# Altium project SPEXTRO_PowerBoard.PrjPcb
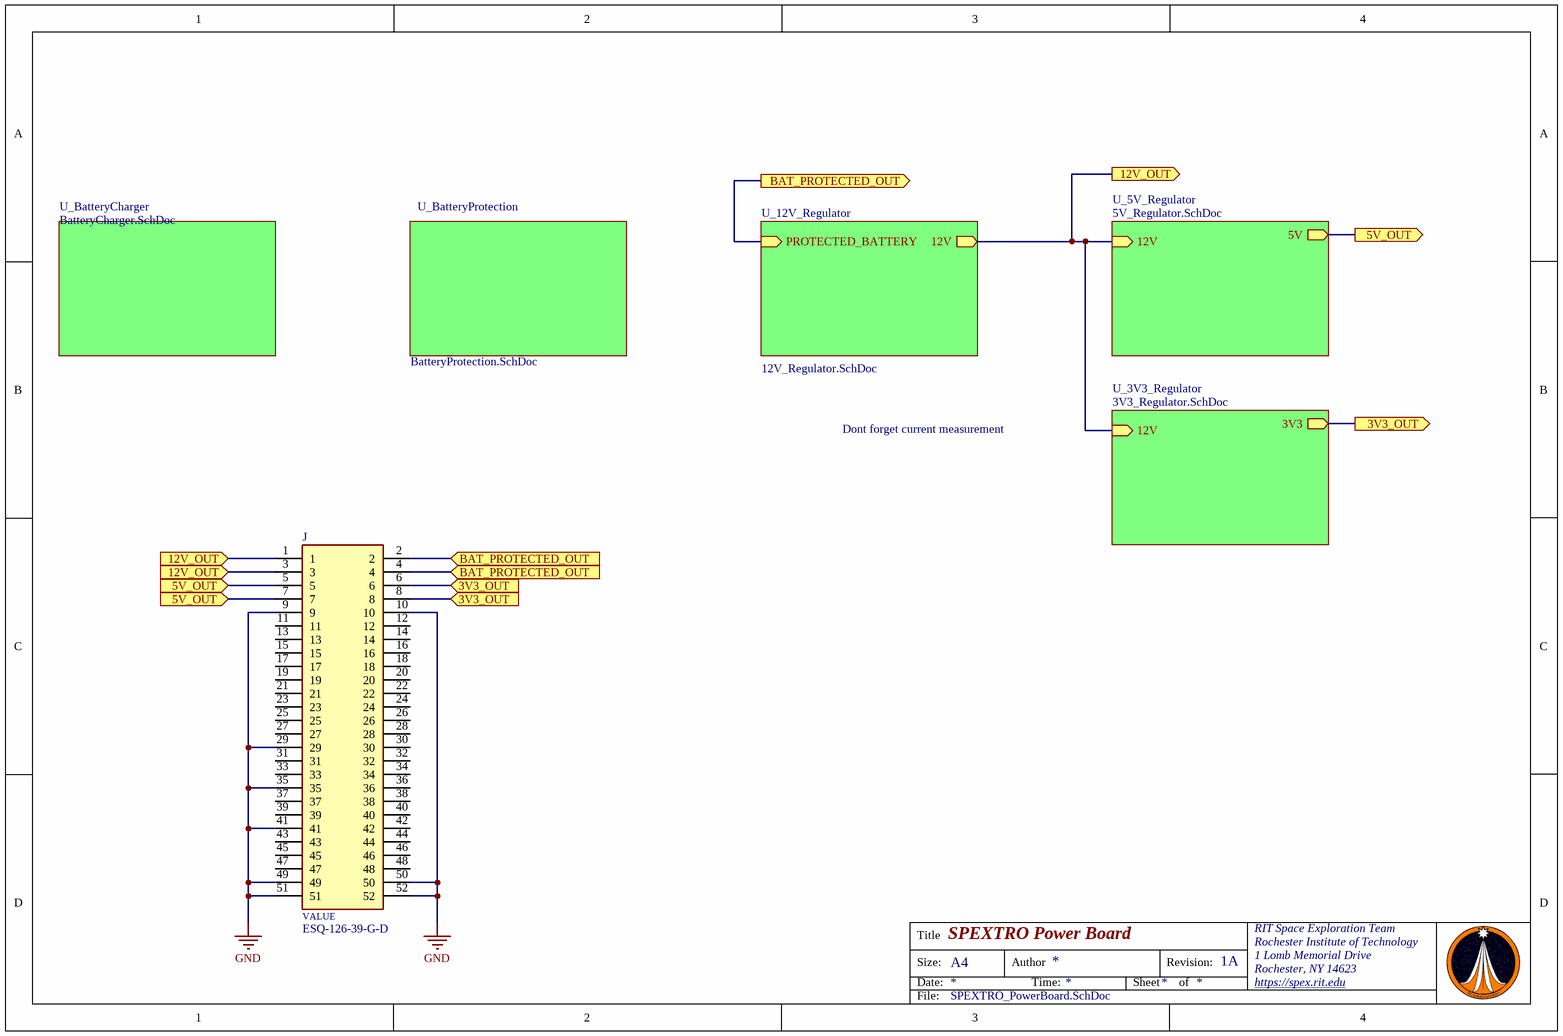
[diagram p0: SPEXTRO_PowerBoard.SchDoc]
6 sheets, 37 parts. Net scope: hierarchical (ports join the sheet entries above them; power ports are global).
Sheets:
  SPEXTRO_PowerBoard.SchDoc
    U_BatteryCharger = BatteryCharger.SchDoc
    U_BatteryProtection = BatteryProtection.SchDoc
    U_12V_Regulator = 12V_Regulator.SchDoc
    U_5V_Regulator = 5V_Regulator.SchDoc
    U_3V3_Regulator = 3V3_Regulator.SchDoc

## Sheet SPEXTRO_PowerBoard.SchDoc: SPEXTRO Power Board
size A4; Revision: 1A

### Parts
J  ESQ-126-39-G-D  [SAMTEC_ESQ-126-39-G-D]

### Sub-sheets
U_3V3_Regulator = 3V3_Regulator.SchDoc: 3V3 (out), 12V (in)
U_5V_Regulator = 5V_Regulator.SchDoc: 5V (out), 12V (in)
U_12V_Regulator = 12V_Regulator.SchDoc: PROTECTED_BATTERY (in), 12V (out)
U_BatteryCharger = BatteryCharger.SchDoc: no entries
U_BatteryProtection = BatteryProtection.SchDoc: no entries

### Ports
3V3_OUT (in), 3V3_OUT (out), 5V_OUT (in), 5V_OUT (out), 12V_OUT (in), 12V_OUT (out), BAT_PROTECTED_OUT (in), BAT_PROTECTED_OUT (out)

### Nets
GND: J.9 J.10 J.29 J.35 J.41 J.49 J.50 J.51 J.52
NetC?#2_2: J.2 J.4 ; port BAT_PROTECTED_OUT, sheet U_12V_Regulator/PROTECTED_BATTERY
NetC?#4_2: J.1 J.3 ; port 12V_OUT, sheet U_12V_Regulator/12V, sheet U_5V_Regulator/12V, sheet U_3V3_Regulator/12V
NetC?#13_2: J.5 J.7 ; port 5V_OUT, sheet U_5V_Regulator/5V
NetC?#17_2: J.6 J.8 ; port 3V3_OUT, sheet U_3V3_Regulator/3V3

Not connected (* = marked no-connect by the designer): J 11 12 13 14 15 16 17 18 19 20 21 22 23 24 25 26 27 28 30 31 32 33 34 36 37 38 39 40 42 43 44 45 46 47 48

### Notes on the sheet
- Dont forget current measurement
- Title
- Size:
- Date:
- A4
- Author
- Time:
- Sheet
- Revision:
- of
- RIT Space Exploration Team
- Rochester Institute of Technology
- 1 Lomb Memorial Drive
- Rochester, NY 14623
- https://spex.rit.edu
- File:
- (in symbol ESQ-126-39-G-D) VALUE

### Library data of the parts
J = ESQ-126-39-G-D: 52 Position Elevated Socket Connector Through Hole; MF: Samtec; Value: *; Digi-Key_Purchase_URL: https://www.digikey.com/product-detail/en/samtec-inc/ESQ-126-39-G-D/SAM10462-ND/3601055?utm_source=snapeda&utm_medium=aggregator&utm_campaign=symbol; Package: None; MP: ESQ-126-39-G-D; SnapEDA_Link: https://www.snapeda.com/parts/ESQ-126-39-G-D/Samtec%20Inc./view-part/490181/?ref=snap; Digi-Key_Part_Number: SAM10462-ND

## Sheet BatteryCharger.SchDoc
size A

## Sheet BatteryProtection.SchDoc
size A

## Sheet 12V_Regulator.SchDoc
size A4
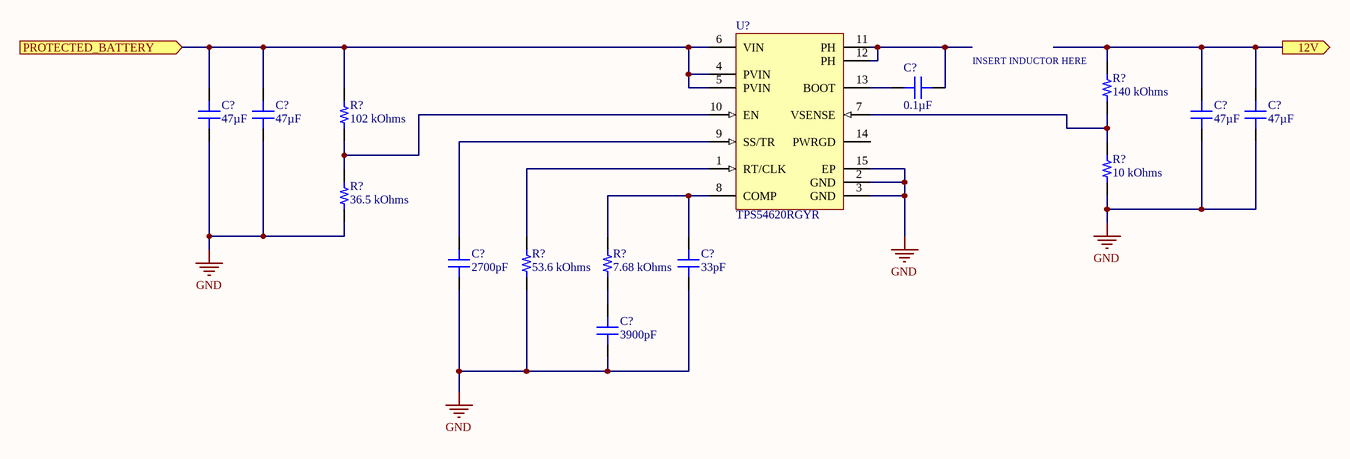
[diagram p1: 12V_Regulator.SchDoc]

### Parts
(Parts that share a designator on the sheet are numbered #1, #2 ... from top to bottom, then left to right.)
C?#1  0.1µF  [CAP 0603_1608]
C?#2  47µF  [CAP 1206_3216 - 1.8MM]
C?#3  47µF  [CAP 1206_3216 - 1.8MM]
C?#4  47µF  [CAP 1206_3216 - 1.8MM]
C?#5  47µF  [CAP 1206_3216 - 1.8MM]
C?#6  2700pF  [CAP 0603_1608]
C?#7  33pF  [CAP 0603_1608]
C?#8  3900pF  [CAP 0603_1608]
R?#1  140 kOhms  [RES 0603_1608]
R?#2  102 kOhms  [RES 0603_1608]
R?#3  10 kOhms  [RES 0603_1608]
R?#4  36.5 kOhms  [RES 0603_1608]
R?#5  53.6 kOhms  [RES 0603_1608]
R?#6  7.68 kOhms  [RES 0603_1608]
U?#1  TPS54620RGYR  [RHL0014A_V]

### Ports
12V (out), PROTECTED_BATTERY (in)

### Nets
GND: C?#2.1 C?#3.1 C?#4.1 C?#5.1 C?#6.1 C?#7.1 C?#8.1 R?#3.1 R?#4.1 R?#5.1 U?#1.2(GND) U?#1.3(GND) U?#1.15(EP)
NetC?#1_1: C?#1.1 U?#1.13(BOOT)
NetC?#1_2: C?#1.2 U?#1.11(PH) U?#1.12(PH)
NetC?#2_2: C?#2.2 C?#3.2 R?#2.2 U?#1.4(PVIN) U?#1.5(PVIN) U?#1.6(VIN) ; port PROTECTED_BATTERY
NetC?#4_2: C?#4.2 C?#5.2 R?#1.2 ; port 12V
NetC?#6_2: C?#6.2 U?#1.9(SS/TR)
NetC?#7_2: C?#7.2 R?#6.2 U?#1.8(COMP)
NetC?#8_2: C?#8.2 R?#6.1
NetR?#1_1: R?#1.1 R?#3.2 U?#1.7(VSENSE)
NetR?#2_1: R?#2.1 R?#4.2 U?#1.10(EN)
NetR?#5_2: R?#5.2 U?#1.1(RT/CLK)

Not connected (* = marked no-connect by the designer): U?#1 14(PWRGD)

### Notes on the sheet
- INSERT INDUCTOR HERE
- Title
- Size:
- Date:
- A4
- Number:
- Time:
- Revision:
- Sheet
- of
- File:

### Library data of the parts
C?#1 = CL10B104KB85PNL: CAP CER 0.1UF 50V X7R 0603; Manufacturer: Samsung Electro-Mechanics; Tolerance: ±10%; Part Number: CL10B104KB85PNL; Value: 0.1µF; Applications: Automotive; Capacitance: 0.1µF; ComponentLink1Description: Datasheet; ComponentLink1URL: http://www.samsungsem.com/kr/support/product-search/mlcc/CL10B104KB85PNL.jsp; ComponentLink2Description: DigiKey Link; ComponentLink2URL: http://digikey.com/product-detail/en/samsung-electro-mechanics/CL10B104KB85PNL/1276-6994-1-ND/7320636; Device Package: 0603 (1608 Metric); LastUpdated: 1/21/2020 12:01:52 AM; Lifecycle Status: Active; Minimum Order: 1; Mounting Type: Surface Mount, MLCC; Operating Temperature: -55°C ~ 125°C; Package / Case: 0603 (1608 Metric); Packaging: TapeAndReel; PartId: 13153; Part Status: Active; Price: 0.02; Ratings: AEC-Q200; Series: CL; Size / Dimension: 0.063" L x 0.031" W (1.60mm x 0.80mm); Supplier 1: DigiKey; Supplier Part Number 1: 1276-6994-1-ND; Temperature Coefficient: X7R; Thickness (Max): 0.035" (0.90mm); Voltage - Rated: 50V
C?#2-C?#5 = GRM31CR61E476ME44L: CAP CER 47UF 25V X5R 1206; Manufacturer: Murata Electronics; Tolerance: ±20%; Part Number: GRM31CR61E476ME44L; Value: 47µF; Applications: General Purpose; Capacitance: 47µF; ComponentLink2Description: DigiKey Link; ComponentLink2URL: http://digikey.com/product-detail/en/murata-electronics/GRM31CR61E476ME44L/490-16268-1-ND/7363259; Device Package: 1206 (3216 Metric); LastUpdated: 1/21/2020 12:03:34 AM; Lifecycle Status: Active; Minimum Order: 1; Mounting Type: Surface Mount, MLCC; Operating Temperature: -55°C ~ 85°C; Package / Case: 1206 (3216 Metric); Packaging: TapeAndReel; PartId: 22811; Part Status: Active; Price: 0.36; Series: GRM; Size / Dimension: 0.126" L x 0.063" W (3.20mm x 1.60mm); Supplier 1: DigiKey; Supplier Part Number 1: 490-16268-1-ND; Temperature Coefficient: X5R; Thickness (Max): 0.071" (1.80mm); Voltage - Rated: 25V
C?#6 = CL10B272KB8NNNC: CAP CER 2700PF 50V X7R 0603; Manufacturer: Samsung Electro-Mechanics; Tolerance: ±10%; Part Number: CL10B272KB8NNNC; Value: 2700pF; Applications: General Purpose; Capacitance: 2700pF; ComponentLink1Description: Datasheet; ComponentLink1URL: http://www.samsungsem.com/kr/support/product-search/mlcc/CL10B272KB8NNNC.jsp; ComponentLink2Description: DigiKey Link; ComponentLink2URL: http://digikey.com/product-detail/en/samsung-electro-mechanics/CL10B272KB8NNNC/1276-2022-1-ND/3890108; Device Package: 0603 (1608 Metric); LastUpdated: 1/21/2020 12:01:43 AM; Lifecycle Status: Active; Minimum Order: 1; Mounting Type: Surface Mount, MLCC; Operating Temperature: -55°C ~ 125°C; Package / Case: 0603 (1608 Metric); Packaging: TapeAndReel; PartId: 16107; Part Status: Active; Price: 0.01; Series: CL; Size / Dimension: 0.063" L x 0.031" W (1.60mm x 0.80mm); Supplier 1: DigiKey; Supplier Part Number 1: 1276-2022-1-ND; Temperature Coefficient: X7R; Thickness (Max): 0.035" (0.90mm); Voltage - Rated: 50V
C?#7 = CC0603JRNPO8BN330: CAP CER 33PF 25V NPO 0603; Manufacturer: Yageo; Temperature Coefficient: C0G, NP0; Tolerance: ±5%; Part Number: CC0603JRNPO8BN330; Value: 33pF; Applications: General Purpose; Capacitance: 33pF; ComponentLink1Description: Datasheet; ComponentLink1URL: https://www.yageo.com/upload/media/product/productsearch/datasheet/mlcc/UPY-GP_NP0_16V-to-50V_17.pdf; ComponentLink2Description: DigiKey Link; ComponentLink2URL: http://digikey.com/product-detail/en/yageo/CC0603JRNPO8BN330/311-3954-1-ND/8025043; Device Package: 0603 (1608 Metric); LastUpdated: 1/21/2020 12:01:58 AM; Lifecycle Status: Active; Minimum Order: 1; Mounting Type: Surface Mount, MLCC; Operating Temperature: -55°C ~ 125°C; Package / Case: 0603 (1608 Metric); Packaging: TapeAndReel; PartId: 9441; Part Status: Active; Price: 0.01; Series: CC; Size / Dimension: 0.063" L x 0.031" W (1.60mm x 0.80mm); Supplier 1: DigiKey; Supplier Part Number 1: 311-3954-1-ND; Thickness (Max): 0.035" (0.90mm); Voltage - Rated: 25V
C?#8 = CC0603KRX7R8BB392: CAP CER 3900PF 25V X7R 0603; Manufacturer: Yageo; Tolerance: ±10%; Part Number: CC0603KRX7R8BB392; Value: 3900pF; Applications: General Purpose; Capacitance: 3900pF; ComponentLink1Description: Datasheet; ComponentLink1URL: https://www.yageo.com/upload/media/product/productsearch/datasheet/mlcc/UPY-GPHC_X7R_6.3V-to-50V_18.pdf; ComponentLink2Description: DigiKey Link; ComponentLink2URL: http://digikey.com/product-detail/en/yageo/CC0603KRX7R8BB392/311-4085-1-ND/8025174; Device Package: 0603 (1608 Metric); LastUpdated: 1/21/2020 12:01:44 AM; Lifecycle Status: Active; Minimum Order: 1; Mounting Type: Surface Mount, MLCC; Operating Temperature: -55°C ~ 125°C; Package / Case: 0603 (1608 Metric); Packaging: TapeAndReel; PartId: 15737; Part Status: Active; Price: 0.01; Series: CC; Size / Dimension: 0.063" L x 0.031" W (1.60mm x 0.80mm); Supplier 1: DigiKey; Supplier Part Number 1: 311-4085-1-ND; Temperature Coefficient: X7R; Thickness (Max): 0.035" (0.90mm); Voltage - Rated: 25V
R?#1 = RMCF0603FT140K: RES 140K OHM 1% 1/10W 0603; Manufacturer: Stackpole Electronics Inc; Power (Watts): 0.1W, 1/10W; Temperature Coefficient: ±100ppm/°C; Part Number: RMCF0603FT140K; Value: 140 kOhms; ComponentLink1Description: Datasheet; ComponentLink1URL: https://www.seielect.com/catalog/sei-packaging.pdf; ComponentLink2Description: DigiKey Link; ComponentLink2URL: http://digikey.com/product-detail/en/stackpole-electronics-inc/RMCF0603FT140K/RMCF0603FT140KCT-ND/4250692; Composition: Thick Film; Device Package: 0603 (1608 Metric); Features: Automotive AEC-Q200; Height - Seated (Max): 0.022" (0.55mm); LastUpdated: 1/21/2020 12:22:36 AM; Lifecycle Status: Active; Minimum Order: 1; Number of Terminations: 2; Operating Temperature: -55°C ~ 155°C; Package / Case: 0603 (1608 Metric); Packaging: CutTape; PartId: 10763; Part Status: Active; Price: 0.10; Ratings: AEC-Q200; Resistance: 140 kOhms; Series: RMCF; Size / Dimension: 0.061" L x 0.031" W (1.55mm x 0.80mm); Supplier 1: DigiKey; Supplier Part Number 1: RMCF0603FT140KCT-ND; Supplier Device Package: 0603; Tolerance: ±1%
R?#2 = RMCF0603FT102K: RES 102K OHM 1% 1/10W 0603; Manufacturer: Stackpole Electronics Inc; Power (Watts): 0.1W, 1/10W; Temperature Coefficient: ±100ppm/°C; Part Number: RMCF0603FT102K; Value: 102 kOhms; ComponentLink1Description: Datasheet; ComponentLink1URL: https://www.seielect.com/catalog/sei-packaging.pdf; ComponentLink2Description: DigiKey Link; ComponentLink2URL: http://digikey.com/product-detail/en/stackpole-electronics-inc/RMCF0603FT102K/RMCF0603FT102KCT-ND/2417908; Composition: Thick Film; Device Package: 0603 (1608 Metric); Features: Automotive AEC-Q200; Height - Seated (Max): 0.022" (0.55mm); LastUpdated: 1/21/2020 12:22:31 AM; Lifecycle Status: Active; Minimum Order: 1; Number of Terminations: 2; Operating Temperature: -55°C ~ 155°C; Package / Case: 0603 (1608 Metric); Packaging: CutTape; PartId: 10887; Part Status: Active; Price: 0.10; Ratings: AEC-Q200; Resistance: 102 kOhms; Series: RMCF; Size / Dimension: 0.061" L x 0.031" W (1.55mm x 0.80mm); Supplier 1: DigiKey; Supplier Part Number 1: RMCF0603FT102KCT-ND; Supplier Device Package: 0603; Tolerance: ±1%
R?#3 = RNCP0603FTD10K0: RES 10K OHM 1% 1/8W 0603; Manufacturer: Stackpole Electronics Inc; Power (Watts): 0.125W, 1/8W; Temperature Coefficient: ±100ppm/°C; Part Number: RNCP0603FTD10K0; Value: 10 kOhms; ComponentLink1Description: Datasheet; ComponentLink1URL: https://www.seielect.com/catalog/sei-rncp.pdf; ComponentLink2Description: DigiKey Link; ComponentLink2URL: http://digikey.com/product-detail/en/stackpole-electronics-inc/RNCP0603FTD10K0/RNCP0603FTD10K0CT-ND/2240478; Composition: Thin Film; Device Package: 0603 (1608 Metric); Features: Anti-Sulfur, Moisture Resistant; Height - Seated (Max): 0.020" (0.50mm); LastUpdated: 1/21/2020 12:17:35 AM; Lifecycle Status: Active; Minimum Order: 1; Number of Terminations: 2; Operating Temperature: -55°C ~ 155°C; Package / Case: 0603 (1608 Metric); Packaging: TapeAndReel; PartId: 22616; Part Status: Active; Price: 0.01; Resistance: 10 kOhms; Series: RNCP; Size / Dimension: 0.059" L x 0.031" W (1.50mm x 0.80mm); Supplier 1: DigiKey; Supplier Part Number 1: RNCP0603FTD10K0CT-ND; Supplier Device Package: 0603; Tolerance: ±1%
R?#4 = RMCF0603FT36K5: RES 36.5K OHM 1% 1/10W 0603; Manufacturer: Stackpole Electronics Inc; Power (Watts): 0.1W, 1/10W; Temperature Coefficient: ±100ppm/°C; Part Number: RMCF0603FT36K5; Value: 36.5 kOhms; ComponentLink1Description: Datasheet; ComponentLink1URL: https://www.seielect.com/catalog/sei-rmcf_rmcp.pdf; ComponentLink2Description: DigiKey Link; ComponentLink2URL: http://digikey.com/product-detail/en/stackpole-electronics-inc/RMCF0603FT36K5/RMCF0603FT36K5CT-ND/1943093; Composition: Thick Film; Device Package: 0603 (1608 Metric); Features: Automotive AEC-Q200; Height - Seated (Max): 0.022" (0.55mm); LastUpdated: 1/21/2020 12:20:18 AM; Lifecycle Status: Active; Minimum Order: 1; Number of Terminations: 2; Operating Temperature: -55°C ~ 155°C; Package / Case: 0603 (1608 Metric); Packaging: CutTape; PartId: 16362; Part Status: Active; Price: 0.10; Ratings: AEC-Q200; Resistance: 36.5 kOhms; Series: RMCF; Size / Dimension: 0.061" L x 0.031" W (1.55mm x 0.80mm); Supplier 1: DigiKey; Supplier Part Number 1: RMCF0603FT36K5CT-ND; Supplier Device Package: 0603; Tolerance: ±1%
R?#5 = RMCF0603FT53K6: RES 53.6K OHM 1% 1/10W 0603; Manufacturer: Stackpole Electronics Inc; Power (Watts): 0.1W, 1/10W; Temperature Coefficient: ±100ppm/°C; Part Number: RMCF0603FT53K6; Value: 53.6 kOhms; ComponentLink1Description: Datasheet; ComponentLink1URL: https://www.seielect.com/catalog/sei-rmcf_rmcp.pdf; ComponentLink2Description: DigiKey Link; ComponentLink2URL: http://digikey.com/product-detail/en/stackpole-electronics-inc/RMCF0603FT53K6/RMCF0603FT53K6CT-ND/1943104; Composition: Thick Film; Device Package: 0603 (1608 Metric); Features: Automotive AEC-Q200; Height - Seated (Max): 0.022" (0.55mm); LastUpdated: 1/21/2020 12:16:54 AM; Lifecycle Status: Active; Minimum Order: 1; Number of Terminations: 2; Operating Temperature: -55°C ~ 155°C; Package / Case: 0603 (1608 Metric); Packaging: CutTape; PartId: 23477; Part Status: Active; Price: 0.10; Ratings: AEC-Q200; Resistance: 53.6 kOhms; Series: RMCF; Size / Dimension: 0.061" L x 0.031" W (1.55mm x 0.80mm); Supplier 1: DigiKey; Supplier Part Number 1: RMCF0603FT53K6CT-ND; Supplier Device Package: 0603; Tolerance: ±1%
R?#6 = RMCF0603FT7K68: RES 7.68K OHM 1% 1/10W 0603; Manufacturer: Stackpole Electronics Inc; Power (Watts): 0.1W, 1/10W; Temperature Coefficient: ±100ppm/°C; Part Number: RMCF0603FT7K68; Value: 7.68 kOhms; ComponentLink1Description: Datasheet; ComponentLink1URL: https://www.seielect.com/catalog/sei-rmcf_rmcp.pdf; ComponentLink2Description: DigiKey Link; ComponentLink2URL: http://digikey.com/product-detail/en/stackpole-electronics-inc/RMCF0603FT7K68/RMCF0603FT7K68CT-ND/4425120; Composition: Thick Film; Device Package: 0603 (1608 Metric); Features: Automotive AEC-Q200; Height - Seated (Max): 0.022" (0.55mm); LastUpdated: 1/21/2020 12:18:38 AM; Lifecycle Status: Active; Minimum Order: 1; Number of Terminations: 2; Operating Temperature: -55°C ~ 155°C; Package / Case: 0603 (1608 Metric); Packaging: CutTape; PartId: 20370; Part Status: Active; Price: 0.10; Ratings: AEC-Q200; Resistance: 7.68 kOhms; Series: RMCF; Size / Dimension: 0.061" L x 0.031" W (1.55mm x 0.80mm); Supplier 1: DigiKey; Supplier Part Number 1: RMCF0603FT7K68CT-ND; Supplier Device Package: 0603; Tolerance: ±1%
U?#1 = CMP-0323-00054-3: Buck Step Down Regulator with 4.5 to 17 V Input and 0.8 to 15 V Output, -40 to 150 degC, 14-Pin VQFN (RGY), Green (RoHS & no Sb/Br); Manufacturer: Texas Instruments; Vout(Max)(V): 15; Vout(Min)(V): 0.8; Rating: Catalog; Vin(Min)(V): 4.5; Iq(Typ)(mA): 0.6; SubFamily: Step-Down Regulator; Synchronous Rectification: TRUE; Regulated Outputs(#): 1; Switch Current Limit(Typ)(A): 8; Iout(Max)(A): 6; Duty Cycle(Max)(%): 98; Vin(Max)(V): 17; Eco-Plan: Green (RoHS & no Sb/Br); PackageReference: RHL0014A; PackageVersion: revI, Jun-2011; ComponentLink2Description: Package Specification; Topology: Buck; DatasheetVersion: SLVS949C; ComponentLink3Description: URL Link1; Code_JEDEC: MO-241-BA; ComponentLink1URL: http://www.ti.com/general/docs/lit/getliterature.tsp?genericPartNumber=TPS54620&fileType=pdf; Mounting Technology: Surface Mount; ComponentLink3URL: Samples URL:http://www.ti.com/product/tps54620#samples; ComponentLink1Description: Datasheet; PartNumber: TPS54620RGYR; PackageDescription: 14-Leads Plastic Quad Flatpack No-Lead, 3.5 x 3.5 x 0.9 mm Body, 0.5 mm Pitch; ComponentLink2URL: http://www.ti.com/litv/pdf/mpqf114g

## Sheet 5V_Regulator.SchDoc
size A
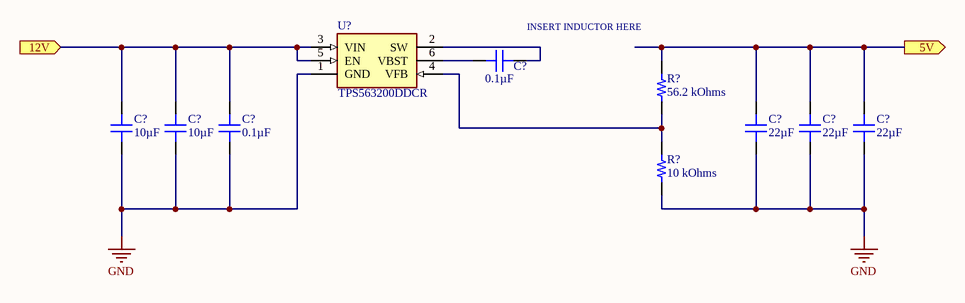
[diagram p2: 5V_Regulator.SchDoc]

### Parts
(Parts that share a designator on the sheet are numbered #1, #2 ... from top to bottom, then left to right.)
C?#9  0.1µF  [CAP 0805_2012]
C?#10  10µF  [CAP 0805_2012]
C?#11  10µF  [CAP 0805_2012]
C?#12  0.1µF  [CAP 0805_2012]
C?#13  22µF  [CAP 0805_2012]
C?#14  22µF  [CAP 0805_2012]
C?#15  22µF  [CAP 0805_2012]
R?#7  56.2 kOhms  [RES 0603_1608]
R?#8  10 kOhms  [RES 0603_1608]
U?#2  TPS563200DDCR  [SOT95P280X110-6N]

### Ports
5V (out), 12V (in)

### Nets
GND: C?#10.1 C?#11.1 C?#12.1 C?#13.1 C?#14.1 C?#15.1 R?#8.1 U?#2.1(GND)
NetC?#4_2: C?#10.2 C?#11.2 C?#12.2 U?#2.3(VIN) U?#2.5(EN) ; port 12V
NetC?#9_1: C?#9.1 U?#2.6(VBST)
NetC?#9_2: C?#9.2 U?#2.2(SW)
NetC?#13_2: C?#13.2 C?#14.2 C?#15.2 R?#7.2 ; port 5V
NetR?#7_1: R?#7.1 R?#8.2 U?#2.4(VFB)

### Notes on the sheet
- (near C?#9) INSERT INDUCTOR HERE

### Library data of the parts
C?#9 C?#12 = UMK212B7104KG-T: CAP CER 0.1UF 50V X7R 0805; Manufacturer: Taiyo Yuden; Tolerance: ±10%; Part Number: UMK212B7104KG-T; Value: 0.1µF; Applications: General Purpose; Capacitance: 0.1µF; ComponentLink1Description: Datasheet; ComponentLink1URL: https://www.yuden.co.jp/productdata/catalog/mlcc01_e.pdf; ComponentLink2Description: DigiKey Link; ComponentLink2URL: http://digikey.com/product-detail/en/taiyo-yuden/UMK212B7104KG-T/587-1279-1-ND/931056; Device Package: 0805 (2012 Metric); LastUpdated: 1/21/2020 12:03:02 AM; Lifecycle Status: Active; Minimum Order: 1; Mounting Type: Surface Mount, MLCC; Operating Temperature: -55°C ~ 125°C; Package / Case: 0805 (2012 Metric); Packaging: TapeAndReel; PartId: 4985; Part Status: Active; Price: 0.02; Series: M; Size / Dimension: 0.079" L x 0.049" W (2.00mm x 1.25mm); Supplier 1: DigiKey; Supplier Part Number 1: 587-1279-1-ND; Temperature Coefficient: X7R; Thickness (Max): 0.053" (1.35mm); Voltage - Rated: 50V
C?#10 C?#11 = TMK212BBJ106KGHT: CAP CER 10UF 25V X5R 0805; Manufacturer: Taiyo Yuden; Tolerance: ±10%; Part Number: TMK212BBJ106KGHT; Value: 10µF; Applications: Automotive; Capacitance: 10µF; ComponentLink1Description: Datasheet; ComponentLink1URL: https://www.yuden.co.jp/productdata/catalog/mlcc_all_hq_e.pdf; ComponentLink2Description: DigiKey Link; ComponentLink2URL: http://digikey.com/product-detail/en/taiyo-yuden/TMK212BBJ106KGHT/587-4334-1-ND/5400908; Device Package: 0805 (2012 Metric); LastUpdated: 1/21/2020 12:03:03 AM; Lifecycle Status: Active; Minimum Order: 1; Mounting Type: Surface Mount, MLCC; Operating Temperature: -55°C ~ 85°C; Package / Case: 0805 (2012 Metric); Packaging: TapeAndReel; PartId: 4818; Part Status: Active; Price: 0.07; Ratings: AEC-Q200; Series: M; Size / Dimension: 0.079" L x 0.049" W (2.00mm x 1.25mm); Supplier 1: DigiKey; Supplier Part Number 1: 587-4334-1-ND; Temperature Coefficient: X5R; Thickness (Max): 0.053" (1.35mm); Voltage - Rated: 25V
C?#13-C?#15 = LMK212BBJ226MG-T: CAP CER 22UF 10V X5R 0805; Manufacturer: Taiyo Yuden; Tolerance: ±20%; Part Number: LMK212BBJ226MG-T; Value: 22µF; Applications: SMPS Filtering; Capacitance: 22µF; ComponentLink1Description: Datasheet; ComponentLink1URL: https://ds.yuden.co.jp/TYCOMPAS/ut/detail?pn=LMK212BBJ226MG-T &u=M; ComponentLink2Description: DigiKey Link; ComponentLink2URL: http://digikey.com/product-detail/en/taiyo-yuden/LMK212BBJ226MG-T/587-5464-1-ND/7067140; Device Package: 0805 (2012 Metric); LastUpdated: 1/21/2020 12:02:43 AM; Lifecycle Status: Active; Minimum Order: 1; Mounting Type: Surface Mount, MLCC; Operating Temperature: -55°C ~ 85°C; Package / Case: 0805 (2012 Metric); Packaging: TapeAndReel; PartId: 16243; Part Status: Active; Price: 0.06; Series: M; Size / Dimension: 0.079" L x 0.049" W (2.00mm x 1.25mm); Supplier 1: DigiKey; Supplier Part Number 1: 587-5464-1-ND; Temperature Coefficient: X5R; Thickness (Max): 0.057" (1.45mm); Voltage - Rated: 10V
R?#7 = RMCF0603FT56K2: RES 56.2K OHM 1% 1/10W 0603; Manufacturer: Stackpole Electronics Inc; Power (Watts): 0.1W, 1/10W; Temperature Coefficient: ±100ppm/°C; Part Number: RMCF0603FT56K2; Value: 56.2 kOhms; ComponentLink1Description: Datasheet; ComponentLink1URL: https://www.seielect.com/catalog/sei-rmcf_rmcp.pdf; ComponentLink2Description: DigiKey Link; ComponentLink2URL: http://digikey.com/product-detail/en/stackpole-electronics-inc/RMCF0603FT56K2/RMCF0603FT56K2CT-ND/1943105; Composition: Thick Film; Device Package: 0603 (1608 Metric); Features: Automotive AEC-Q200; Height - Seated (Max): 0.022" (0.55mm); LastUpdated: 1/21/2020 12:22:37 AM; Lifecycle Status: Active; Minimum Order: 1; Number of Terminations: 2; Operating Temperature: -55°C ~ 155°C; Package / Case: 0603 (1608 Metric); Packaging: CutTape; PartId: 10739; Part Status: Active; Price: 0.10; Ratings: AEC-Q200; Resistance: 56.2 kOhms; Series: RMCF; Size / Dimension: 0.061" L x 0.031" W (1.55mm x 0.80mm); Supplier 1: DigiKey; Supplier Part Number 1: RMCF0603FT56K2CT-ND; Supplier Device Package: 0603; Tolerance: ±1%
R?#8 = TNPW060310K0FHTA: RES 10K OHM 1% 1/10W 0603; Manufacturer: Vishay Dale; Power (Watts): 0.1W, 1/10W; Temperature Coefficient: ±50ppm/°C; Part Number: TNPW060310K0FHTA; Value: 10 kOhms; ComponentLink2Description: DigiKey Link; ComponentLink2URL: http://digikey.com/product-detail/en/vishay-dale/TNPW060310K0FHTA/541-3906-1-ND/7355264; Composition: Thin Film; Device Package: 0603 (1608 Metric); Features: Military; Height - Seated (Max): 0.022" (0.55mm); LastUpdated: 1/21/2020 12:23:11 AM; Lifecycle Status: Active; Minimum Order: 1; Number of Terminations: 2; Operating Temperature: -55°C ~ 125°C; Package / Case: 0603 (1608 Metric); Packaging: TapeAndReel; PartId: 9361; Part Status: Active; Price: 0.07; Resistance: 10 kOhms; Series: TNPW; Size / Dimension: 0.063" L x 0.033" W (1.60mm x 0.85mm); Supplier 1: DigiKey; Supplier Part Number 1: 541-3906-1-ND; Supplier Device Package: 0603; Tolerance: ±1%
U?#2 = TPS563200DDCR: Buck Switching Regulator IC Positive Adjustable 0.76V 1 Output 3A SOT-23-6 Thin, TSOT-23-6; MF: Texas Instruments; Package: TSOT-23 Texas Instruments; Value: *; Price: None; MP: TPS563200DDCR; SnapEDA_Link: https://www.snapeda.com/parts/TPS563200DDCR/Texas%20Instruments/view-part/71685/?ref=snap; Availability: Unavailable

## Sheet 3V3_Regulator.SchDoc
size A
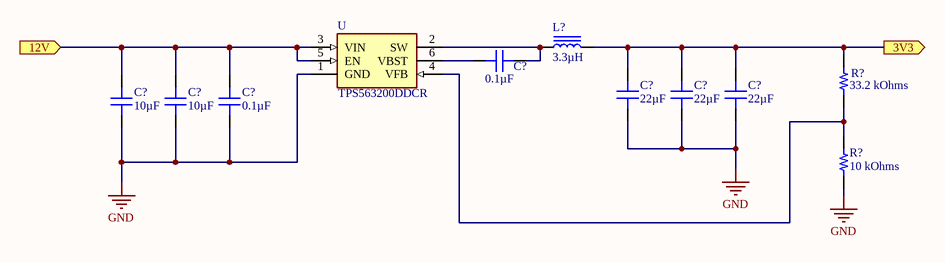
[diagram p3: 3V3_Regulator.SchDoc]

### Parts
(Parts that share a designator on the sheet are numbered #1, #2 ... from top to bottom, then left to right.)
C?#16  0.1µF  [CAP 0805_2012]
C?#17  22µF  [CAP 0805_2012]
C?#18  22µF  [CAP 0805_2012]
C?#19  22µF  [CAP 0805_2012]
C?#20  10µF  [CAP 0805_2012]
C?#21  10µF  [CAP 0805_2012]
C?#22  0.1µF  [CAP 0805_2012]
L?  3.3µH  [TDK VLCF4024-2]
R?#9  33.2 kOhms  [RES 0603_1608]
R?#10  10 kOhms  [RES 0603_1608]
U  TPS563200DDCR  [SOT95P280X110-6N]

### Ports
3V3 (out), 12V (in)

### Nets
GND: C?#17.1 C?#18.1 C?#19.1 C?#20.1 C?#21.1 C?#22.1 R?#10.1 U.1(GND)
NetC?#4_2: C?#20.2 C?#21.2 C?#22.2 U.3(VIN) U.5(EN) ; port 12V
NetC?#16_1: C?#16.1 U.6(VBST)
NetC?#16_2: C?#16.2 L?.1 U.2(SW)
NetC?#17_2: C?#17.2 C?#18.2 C?#19.2 L?.2 R?#9.2 ; port 3V3
NetR?#9_1: R?#9.1 R?#10.2 U.4(VFB)

### Library data of the parts
C?#16 C?#22 = UMK212B7104KG-T: as C?#9 on sheet 5V_Regulator; Part Number: UMK212B7104KG-T; Value: 0.1µF; Applications: General Purpose; Capacitance: 0.1µF; ComponentLink1Description: Datasheet; ComponentLink1URL: https://www.yuden.co.jp/productdata/catalog/mlcc01_e.pdf; ComponentLink2Description: DigiKey Link; ComponentLink2URL: http://digikey.com/product-detail/en/taiyo-yuden/UMK212B7104KG-T/587-1279-1-ND/931056; Device Package: 0805 (2012 Metric); LastUpdated: 1/21/2020 12:03:02 AM; Lifecycle Status: Active; Minimum Order: 1; Mounting Type: Surface Mount, MLCC; Operating Temperature: -55°C ~ 125°C; Package / Case: 0805 (2012 Metric); Packaging: TapeAndReel; PartId: 4985; Part Status: Active; Price: 0.02; Series: M; Size / Dimension: 0.079" L x 0.049" W (2.00mm x 1.25mm); Supplier 1: DigiKey; Supplier Part Number 1: 587-1279-1-ND; Temperature Coefficient: X7R; Thickness (Max): 0.053" (1.35mm); Voltage - Rated: 50V
C?#17-C?#19 = LMK212BBJ226MG-T: as C?#13 on sheet 5V_Regulator; Part Number: LMK212BBJ226MG-T; Value: 22µF; Applications: SMPS Filtering; Capacitance: 22µF; ComponentLink1Description: Datasheet; ComponentLink1URL: https://ds.yuden.co.jp/TYCOMPAS/ut/detail?pn=LMK212BBJ226MG-T &u=M; ComponentLink2Description: DigiKey Link; ComponentLink2URL: http://digikey.com/product-detail/en/taiyo-yuden/LMK212BBJ226MG-T/587-5464-1-ND/7067140; Device Package: 0805 (2012 Metric); LastUpdated: 1/21/2020 12:02:43 AM; Lifecycle Status: Active; Minimum Order: 1; Mounting Type: Surface Mount, MLCC; Operating Temperature: -55°C ~ 85°C; Package / Case: 0805 (2012 Metric); Packaging: TapeAndReel; PartId: 16243; Part Status: Active; Price: 0.06; Series: M; Size / Dimension: 0.079" L x 0.049" W (2.00mm x 1.25mm); Supplier 1: DigiKey; Supplier Part Number 1: 587-5464-1-ND; Temperature Coefficient: X5R; Thickness (Max): 0.057" (1.45mm); Voltage - Rated: 10V
C?#20 C?#21 = TMK212BBJ106KGHT: as C?#10 on sheet 5V_Regulator; Part Number: TMK212BBJ106KGHT; Value: 10µF; Applications: Automotive; Capacitance: 10µF; ComponentLink1Description: Datasheet; ComponentLink1URL: https://www.yuden.co.jp/productdata/catalog/mlcc_all_hq_e.pdf; ComponentLink2Description: DigiKey Link; ComponentLink2URL: http://digikey.com/product-detail/en/taiyo-yuden/TMK212BBJ106KGHT/587-4334-1-ND/5400908; Device Package: 0805 (2012 Metric); LastUpdated: 1/21/2020 12:03:03 AM; Lifecycle Status: Active; Minimum Order: 1; Mounting Type: Surface Mount, MLCC; Operating Temperature: -55°C ~ 85°C; Package / Case: 0805 (2012 Metric); Packaging: TapeAndReel; PartId: 4818; Part Status: Active; Price: 0.07; Ratings: AEC-Q200; Series: M; Size / Dimension: 0.079" L x 0.049" W (2.00mm x 1.25mm); Supplier 1: DigiKey; Supplier Part Number 1: 587-4334-1-ND; Temperature Coefficient: X5R; Thickness (Max): 0.053" (1.35mm); Voltage - Rated: 25V
L? = VLCF5024T-3R3N1R4-2: FIXED IND 3.3UH 1.46A 37 MOHM; Manufacturer: TDK Corporation; DC Resistance (DCR): 37mOhm Max; Inductance Frequency - Test: 100kHz; Material - Core: Ferrite; Shielding: Shielded; Tolerance: ±30%; Type: Wirewound; Part Number: VLCF5024T-3R3N1R4-2; ComponentLink1Description: Datasheet; ComponentLink1URL: https://product.tdk.com/info/en/catalog/datasheets/inductor_commercial_power_vlcf5024-2_en.pdf?ref_disty=digikey; ComponentLink2Description: DigiKey Link; ComponentLink2URL: http://digikey.com/product-detail/en/tdk-corporation/VLCF5024T-3R3N1R4-2/445-8746-1-ND/3083348; Current Rating (Amps): 1.46A; Current - Saturation: 1.46A; Device Package: Nonstandard; Height - Seated (Max): 0.094" (2.40mm); Inductance: 3.3µH; LastUpdated: 1/21/2020 3:26:16 AM; Lifecycle Status: Active; Minimum Order: 1; Mounting Type: Surface Mount; Operating Temperature: -40°C ~ 105°C; Package / Case: Nonstandard; Packaging: TapeAndReel; PartId: 157; Part Status: Active; Price: 0.63; Series: VLCF; Size / Dimension: 0.197" L x 0.197" W (5.00mm x 5.00mm); Supplier 1: DigiKey; Supplier Part Number 1: 445-8746-1-ND; Value: 3.3µH
R?#9 = RT0603FRE0733K2L: RES SMD 33.2K OHM 1% 1/10W 0603; Manufacturer: Yageo; Power (Watts): 0.1W, 1/10W; Temperature Coefficient: ±50ppm/°C; Part Number: RT0603FRE0733K2L; Value: 33.2 kOhms; ComponentLink1Description: Datasheet; ComponentLink1URL: https://www.yageo.com/upload/media/product/productsearch/datasheet/rchip/PYu-RT_1-to-0.01_RoHS_L_11.pdf; ComponentLink2Description: DigiKey Link; ComponentLink2URL: http://digikey.com/product-detail/en/yageo/RT0603FRE0733K2L/YAG5958CT-ND/9370988; Composition: Thin Film; Device Package: 0603 (1608 Metric); Height - Seated (Max): 0.022" (0.55mm); LastUpdated: 1/21/2020 12:20:29 AM; Lifecycle Status: Active; Minimum Order: 1; Number of Terminations: 2; Operating Temperature: -55°C ~ 155°C; Package / Case: 0603 (1608 Metric); Packaging: TapeAndReel; PartId: 16004; Part Status: Active; Price: 0.01; Resistance: 33.2 kOhms; Series: RT; Size / Dimension: 0.063" L x 0.031" W (1.60mm x 0.80mm); Supplier 1: DigiKey; Supplier Part Number 1: YAG5958CT-ND; Supplier Device Package: 0603; Tolerance: ±1%
R?#10 = TNPW060310K0FHTA: as R?#8 on sheet 5V_Regulator; Part Number: TNPW060310K0FHTA; Value: 10 kOhms; ComponentLink2Description: DigiKey Link; ComponentLink2URL: http://digikey.com/product-detail/en/vishay-dale/TNPW060310K0FHTA/541-3906-1-ND/7355264; Composition: Thin Film; Device Package: 0603 (1608 Metric); Features: Military; Height - Seated (Max): 0.022" (0.55mm); LastUpdated: 1/21/2020 12:23:11 AM; Lifecycle Status: Active; Minimum Order: 1; Number of Terminations: 2; Operating Temperature: -55°C ~ 125°C; Package / Case: 0603 (1608 Metric); Packaging: TapeAndReel; PartId: 9361; Part Status: Active; Price: 0.07; Resistance: 10 kOhms; Series: TNPW; Size / Dimension: 0.063" L x 0.033" W (1.60mm x 0.85mm); Supplier 1: DigiKey; Supplier Part Number 1: 541-3906-1-ND; Supplier Device Package: 0603; Tolerance: ±1%
U = TPS563200DDCR: as U?#2 on sheet 5V_Regulator; Package: TSOT-23 Texas Instruments; Value: *; Price: None; MP: TPS563200DDCR; SnapEDA_Link: https://www.snapeda.com/parts/TPS563200DDCR/Texas%20Instruments/view-part/71685/?ref=snap; Availability: Unavailable

## Nets that join several sheets
GND: SPEXTRO_PowerBoard (9 pins), 12V_Regulator (13 pins), 5V_Regulator (8 pins), 3V3_Regulator (8 pins)
NetC?#2_2: SPEXTRO_PowerBoard (J.2 J.4), 12V_Regulator (6 pins)
NetC?#4_2: SPEXTRO_PowerBoard (J.1 J.3), 12V_Regulator (C?#4.2 C?#5.2 R?#1.2), 5V_Regulator (5 pins), 3V3_Regulator (5 pins)
NetC?#13_2: SPEXTRO_PowerBoard (J.5 J.7), 5V_Regulator (C?#13.2 C?#14.2 C?#15.2 R?#7.2)
NetC?#17_2: SPEXTRO_PowerBoard (J.6 J.8), 3V3_Regulator (5 pins)